# Altium schematic sheet 2.WiFi_Arduino Pinout.SchDoc
size A4
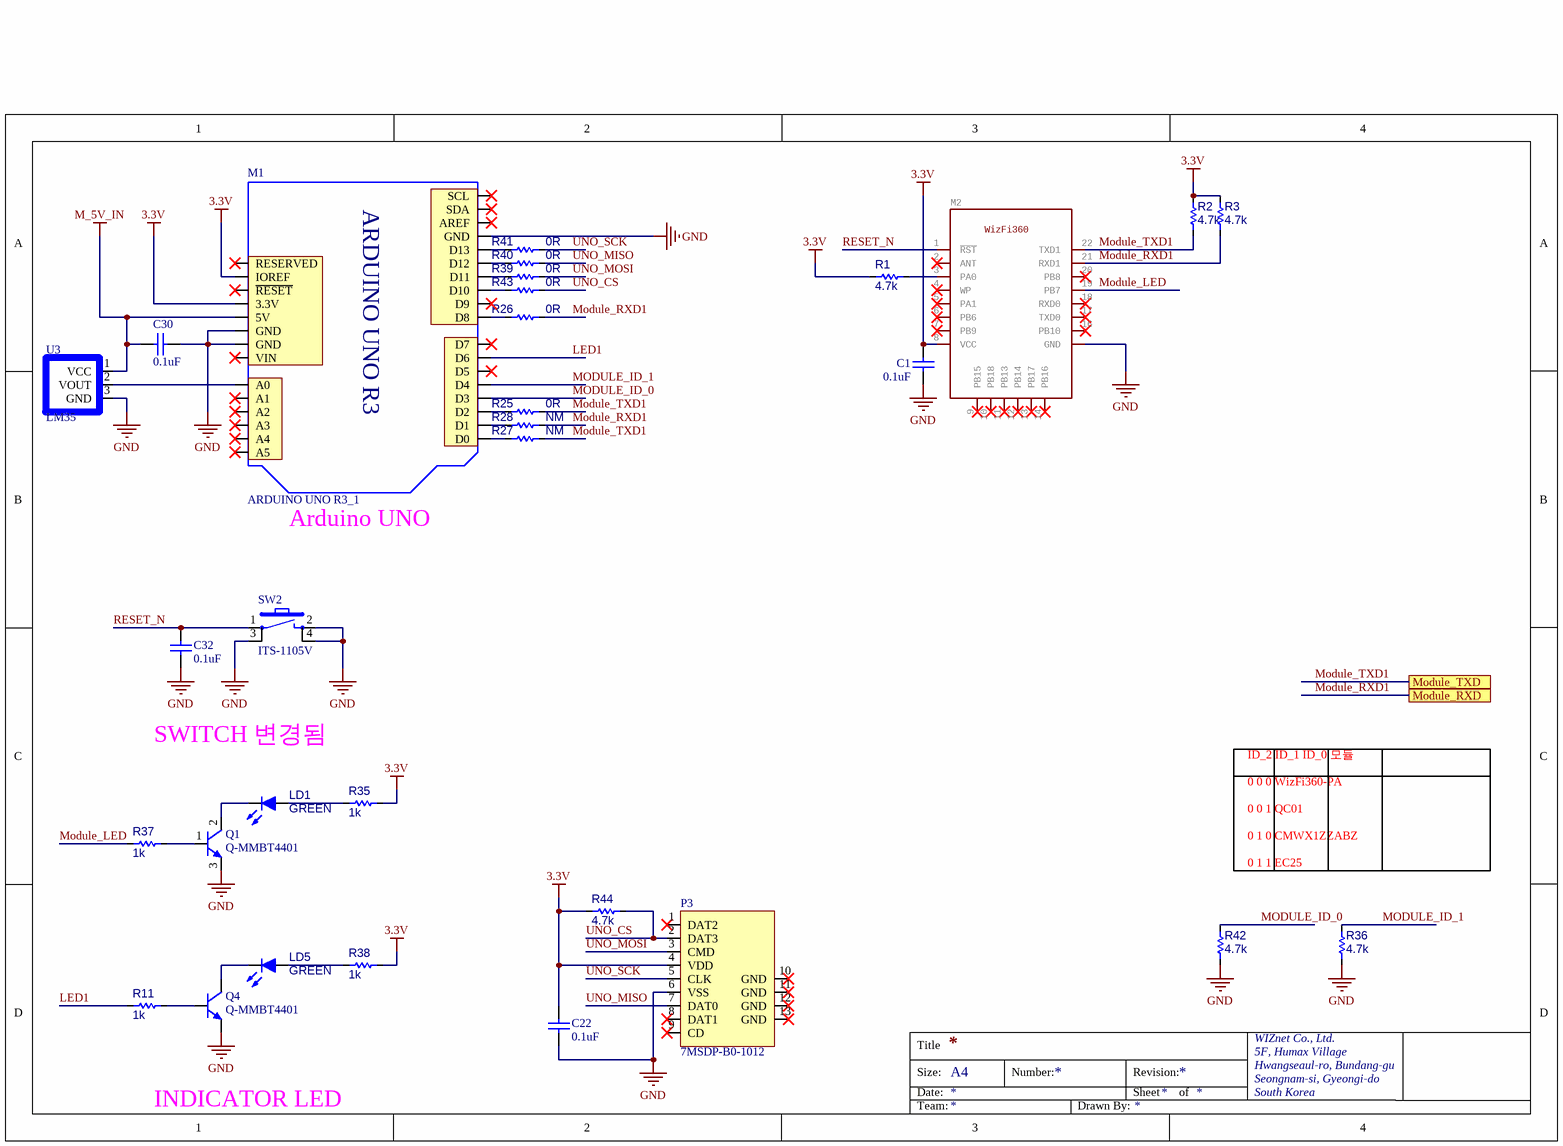
[diagram p0: 2.WiFi_Arduino Pinout.SchDoc]

## Parts
C1  0.1uF  [CAP-0402]
C22  0.1uF  [CAP-0402]
C30  0.1uF  [CAP-0402]
C32  0.1uF  [CAP-0402]
LD1  GREEN  [LED-0603-GREEN]
LD5  GREEN  [LED-0603-GREEN]
M1  ARDUINO UNO R3_1  [ARDUINOR3_ICSP(3)]
M2  WIZFI360  [WizFi360-PA]
P3  7MSDP-B0-1012  [7MSDP-B0-1012]
Q1  Q-MMBT4401  [SOT-23-3LL]
Q4  Q-MMBT4401  [SOT-23-3LL]
R1  4.7k  [RES-0402]
R2  4.7k  [RES-0402]
R3  4.7k  [RES-0402]
R11  1k  [RES-0402]
R25  0R  [RES-0402]
R26  0R  [RES-0402]
R27  NM  [RES-0402]
R28  NM  [RES-0402]
R35  1k  [RES-0402]
R36  4.7k  [RES-0402]
R37  1k  [RES-0402]
R38  1k  [RES-0402]
R39  0R  [RES-0402]
R40  0R  [RES-0402]
R41  0R  [RES-0402]
R42  4.7k  [RES-0402]
R43  0R  [RES-0402]
R44  4.7k  [RES-0402]
SW2  ITS-1105V  [ITS-1105V(DIP)]
U3  LM35  [TO-92]

## Ports
Module_RXD, Module_TXD

## Nets
3.3V: C1.2 C22.1 M1.3.3V M1.IOREF M2.8(VCC) P3.4(VDD) R1.2 R2.1 R3.1 R35.2 R38.2 R44.2
GND: C1.1 C22.2 C30.1 C32.1 M1.GND1(GND) M1.GND2(GND) M1.GND4(GND) M2.15_23_24(GND) P3.6(VSS) Q1.3(E) Q4.3(E) R36.1 R42.1 SW2.2 SW2.3(GND) SW2.4(GND) U3.3(GND)
M_5V_IN: C30.2 M1.5V U3.1(VCC)
LED1: M1.D6 R11.1
MODULE_ID_0: M1.D3 R42.2
MODULE_ID_1: M1.D4 R36.2
Module_LED: M2.19(PB7) R37.1
Module_RXD1: M2.21(RXD1) R3.2 R26.1 R28.1 ; port Module_RXD
Module_TXD1: M2.22(TXD1) R2.2 R25.1 R27.1 ; port Module_TXD
RESET_N: C32.2 M2.1(~{RST}) SW2.1
UNO_CS: P3.2(DAT3) R43.1 R44.1
UNO_MISO: P3.7(DAT0) R40.1
UNO_MOSI: P3.3(CMD) R39.1
UNO_SCK: P3.5(CLK) R41.1
NetLD1_1: LD1.1(A) R35.1
NetLD1_2: LD1.2(K) Q1.2(C)
NetLD5_1: LD5.1(A) R38.1
NetLD5_2: LD5.2(K) Q4.2(C)
NetM1_A0: M1.A0 U3.2(VOUT)
NetM1_D0: M1.D0 R27.2
NetM1_D1: M1.D1 R28.2
NetM1_D2: M1.D2 R25.2
NetM1_D8: M1.D8 R26.2
NetM1_D10: M1.D10 R43.2
NetM1_D11: M1.D11 R39.2
NetM1_D12: M1.D12 R40.2
NetM1_D13: M1.D13 R41.2
NetM2_3: M2.3(PA0) R1.1
NetQ1_1: Q1.1(B) R37.2
NetQ4_1: Q4.1(B) R11.2

Not connected (* = marked no-connect by the designer): M1 \RESET* A1* A2* A3* A4* A5* AREF* D5* D7* D9* RESERVED* SCL* SDA* VIN*; M2 2(ANT)* 4(WP)* 5(PA1)* 6(PB6)* 7(PB9)* 9(PB15)* 10(PB18)* 11(PB13)* 12(PB14)* 13(PB17)* 14(PB16)* 16(PB10)* 17(TXD0)* 18(RXD0)* 20(PB8)*; P3 1(DAT2)* 8(DAT1)* 9(CD)* 10(GND)* 11(GND)* 12(GND)* 13(GND)*

## Notes on the sheet
- Arduino UNO
- SWITCH 변경됨
- ID_2	ID_1	ID_0	모듈
- 0	0	0	WizFi360-PA
- 0	0	1	QC01
- 0	1	0	CMWX1ZZABZ
- 0	1	1	EC25
- INDICATOR LED
- Title
- Size:
- Date:
- A4
- Number:
- Revision:
- Sheet
- of
- WIZnet Co., Ltd.
- 5F, Humax Village
- Hwangseaul-ro, Bundang-gu
- Seongnam-si, Gyeongi-do
- South Korea
- Team:
- Drawn By:
- (in symbol ARDUINO UNO R3_1) ARDUINO UNO R3

## Library data of the parts
C1 C22 C30 C32 = CAP-0402: Ceramic CAP 0402(1005)
LD1 LD5 = LED-0603
M1 = ARDUINO UNO R3_1: Arduino UNO R3
M2 = WIZFI360: GateName_1: G$1; SymbolName_1: WIZFI360; LibraryName: WIZnet; DeviceSetName: WIZFI360; WizFi360: WizFi360
P3 = 7MSDP-B0-1012: Micro SD Card Socket
Q1 Q4 = Q-MMBT4401: NPN General-Purpose Amplifier
R1-R3 R11 R25-R28 R35-R44 = RES-0402
SW2 = SWITCH-ANGLE_TACT: Angle TACT SW, SMD